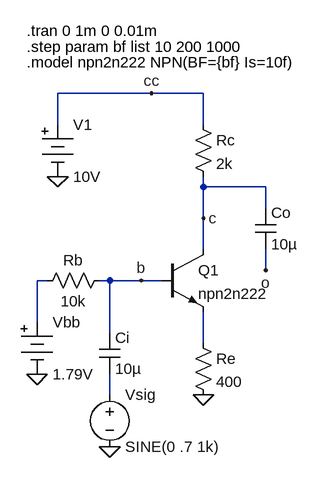
[diagram p0: schematic 26-5-7-a-1.asc]
26-5-7-a-1.asc, the LTspice schematic file:
Version 4
SHEET 1 880 680
WIRE 144 -144 0 -144
WIRE 224 -144 144 -144
WIRE 0 -96 0 -144
WIRE 224 -96 224 -144
WIRE 224 0 224 -16
WIRE 320 0 224 0
WIRE 320 32 320 0
WIRE 224 48 224 0
WIRE 224 96 224 48
WIRE 320 128 320 96
WIRE -16 144 -32 144
WIRE 80 144 64 144
WIRE 128 144 80 144
WIRE 160 144 128 144
WIRE -32 208 -32 144
WIRE 80 224 80 144
WIRE 224 240 224 192
WIRE 80 320 80 288
FLAG 224 48 c
FLAG 128 144 b
FLAG -32 288 0
FLAG 80 400 0
FLAG 224 320 0
FLAG 0 -16 0
FLAG 320 128 o
FLAG 144 -144 cc
SYMBOL Misc\\battery 0 -112 R0
WINDOW 123 0 0 Left 0
WINDOW 39 0 0 Left 0
SYMATTR InstName V1
SYMATTR Value 10V
SYMBOL Misc\\battery -32 192 R0
WINDOW 123 0 0 Left 0
WINDOW 39 0 0 Left 0
SYMATTR InstName Vbb
SYMATTR Value 1.79V
SYMBOL voltage 80 304 R0
WINDOW 123 0 0 Left 0
WINDOW 39 0 0 Left 0
SYMATTR InstName Vsig
SYMATTR Value SINE(0 .7 1k)
SYMBOL cap 64 224 R0
SYMATTR InstName Ci
SYMATTR Value 10µ
SYMBOL cap 304 32 R0
SYMATTR InstName Co
SYMATTR Value 10µ
SYMBOL res 80 128 R90
WINDOW 0 0 56 VBottom 2
WINDOW 3 32 56 VTop 2
SYMATTR InstName Rb
SYMATTR Value 10k
SYMBOL res 208 224 R0
SYMATTR InstName Re
SYMATTR Value 400
SYMBOL res 208 -112 R0
SYMATTR InstName Rc
SYMATTR Value 2k
SYMBOL npn 160 96 R0
SYMATTR InstName Q1
SYMATTR Value npn2n222
TEXT -48 -192 Left 2 !.model npn2n222 NPN(BF={bf} Is=10f)
TEXT -48 -216 Left 2 !.step param bf list 10 200 1000
TEXT -48 -240 Left 2 !.tran 0 1m 0 0.01m

The netlist it stands for:
* 26-5-7-a-1.asc
V1 cc 0 10V
Vbb N001 0 1.79V
Vsig N003 0 SINE(0 .7 1k)
Ci b N003 10µ
Co c o 10µ
Rb b N001 10k
Re N002 0 400
Rc cc c 2k
Q1 c b N002 0 npn2n222
.model NPN NPN
.model PNP PNP
.lib standard.bjt
.model npn2n222 NPN(BF={bf} Is=10f)
.step param bf list 10 200 1000
.tran 0 1m 0 0.01m
.backanno
.end

* Results of the author's LTspice run, read from the files saved beside the schematic
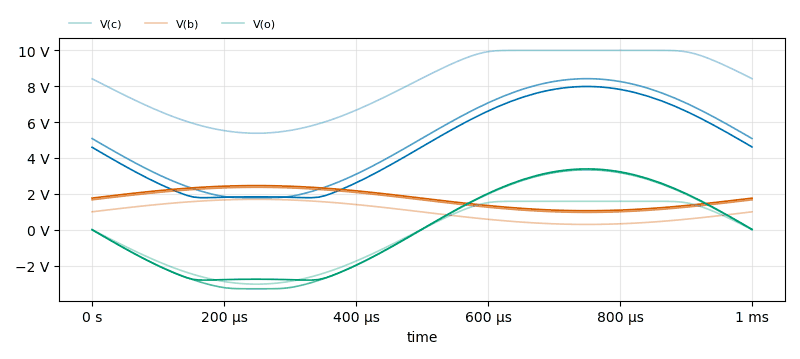
[diagram p1: Transient Analysis of 26-5-7-a-1.asc, plotted from the saved traces]
* Transient Analysis, 3 runs:
*   V(c) [run 1]: min 5.379 V, max 10 V, average 8.101 V, rms 8.292 V, last 8.422 V
*   V(c) [run 2]: min 1.786 V, max 8.421 V, average 5.077 V, rms 5.607 V, last 5.083 V
*   V(c) [run 3]: min 1.785 V, max 7.985 V, average 4.682 V, rms 5.218 V, last 4.614 V
*   V(b) [run 1]: min 294.3 mV, max 1.693 V, average 993.8 mV, rms 1.11 V, last 996.2 mV
*   V(b) [run 2]: min 966.3 mV, max 2.365 V, average 1.666 V, rms 1.738 V, last 1.667 V
*   V(b) [run 3]: min 1.059 V, max 2.459 V, average 1.759 V, rms 1.827 V, last 1.759 V
*   V(o) [run 1]: min -3.036 V, max 1.585 V, average -314 mV, rms 1.796 V, last 6.569 mV
*   V(o) [run 2]: min -3.296 V, max 3.34 V, average -4.716 mV, rms 2.38 V, last 1.568 mV
*   V(o) [run 3]: min -2.81 V, max 3.391 V, average 86.97 mV, rms 2.305 V, last 19.54 mV